# Altium project 24V_InjectorDriver.PrjPcb
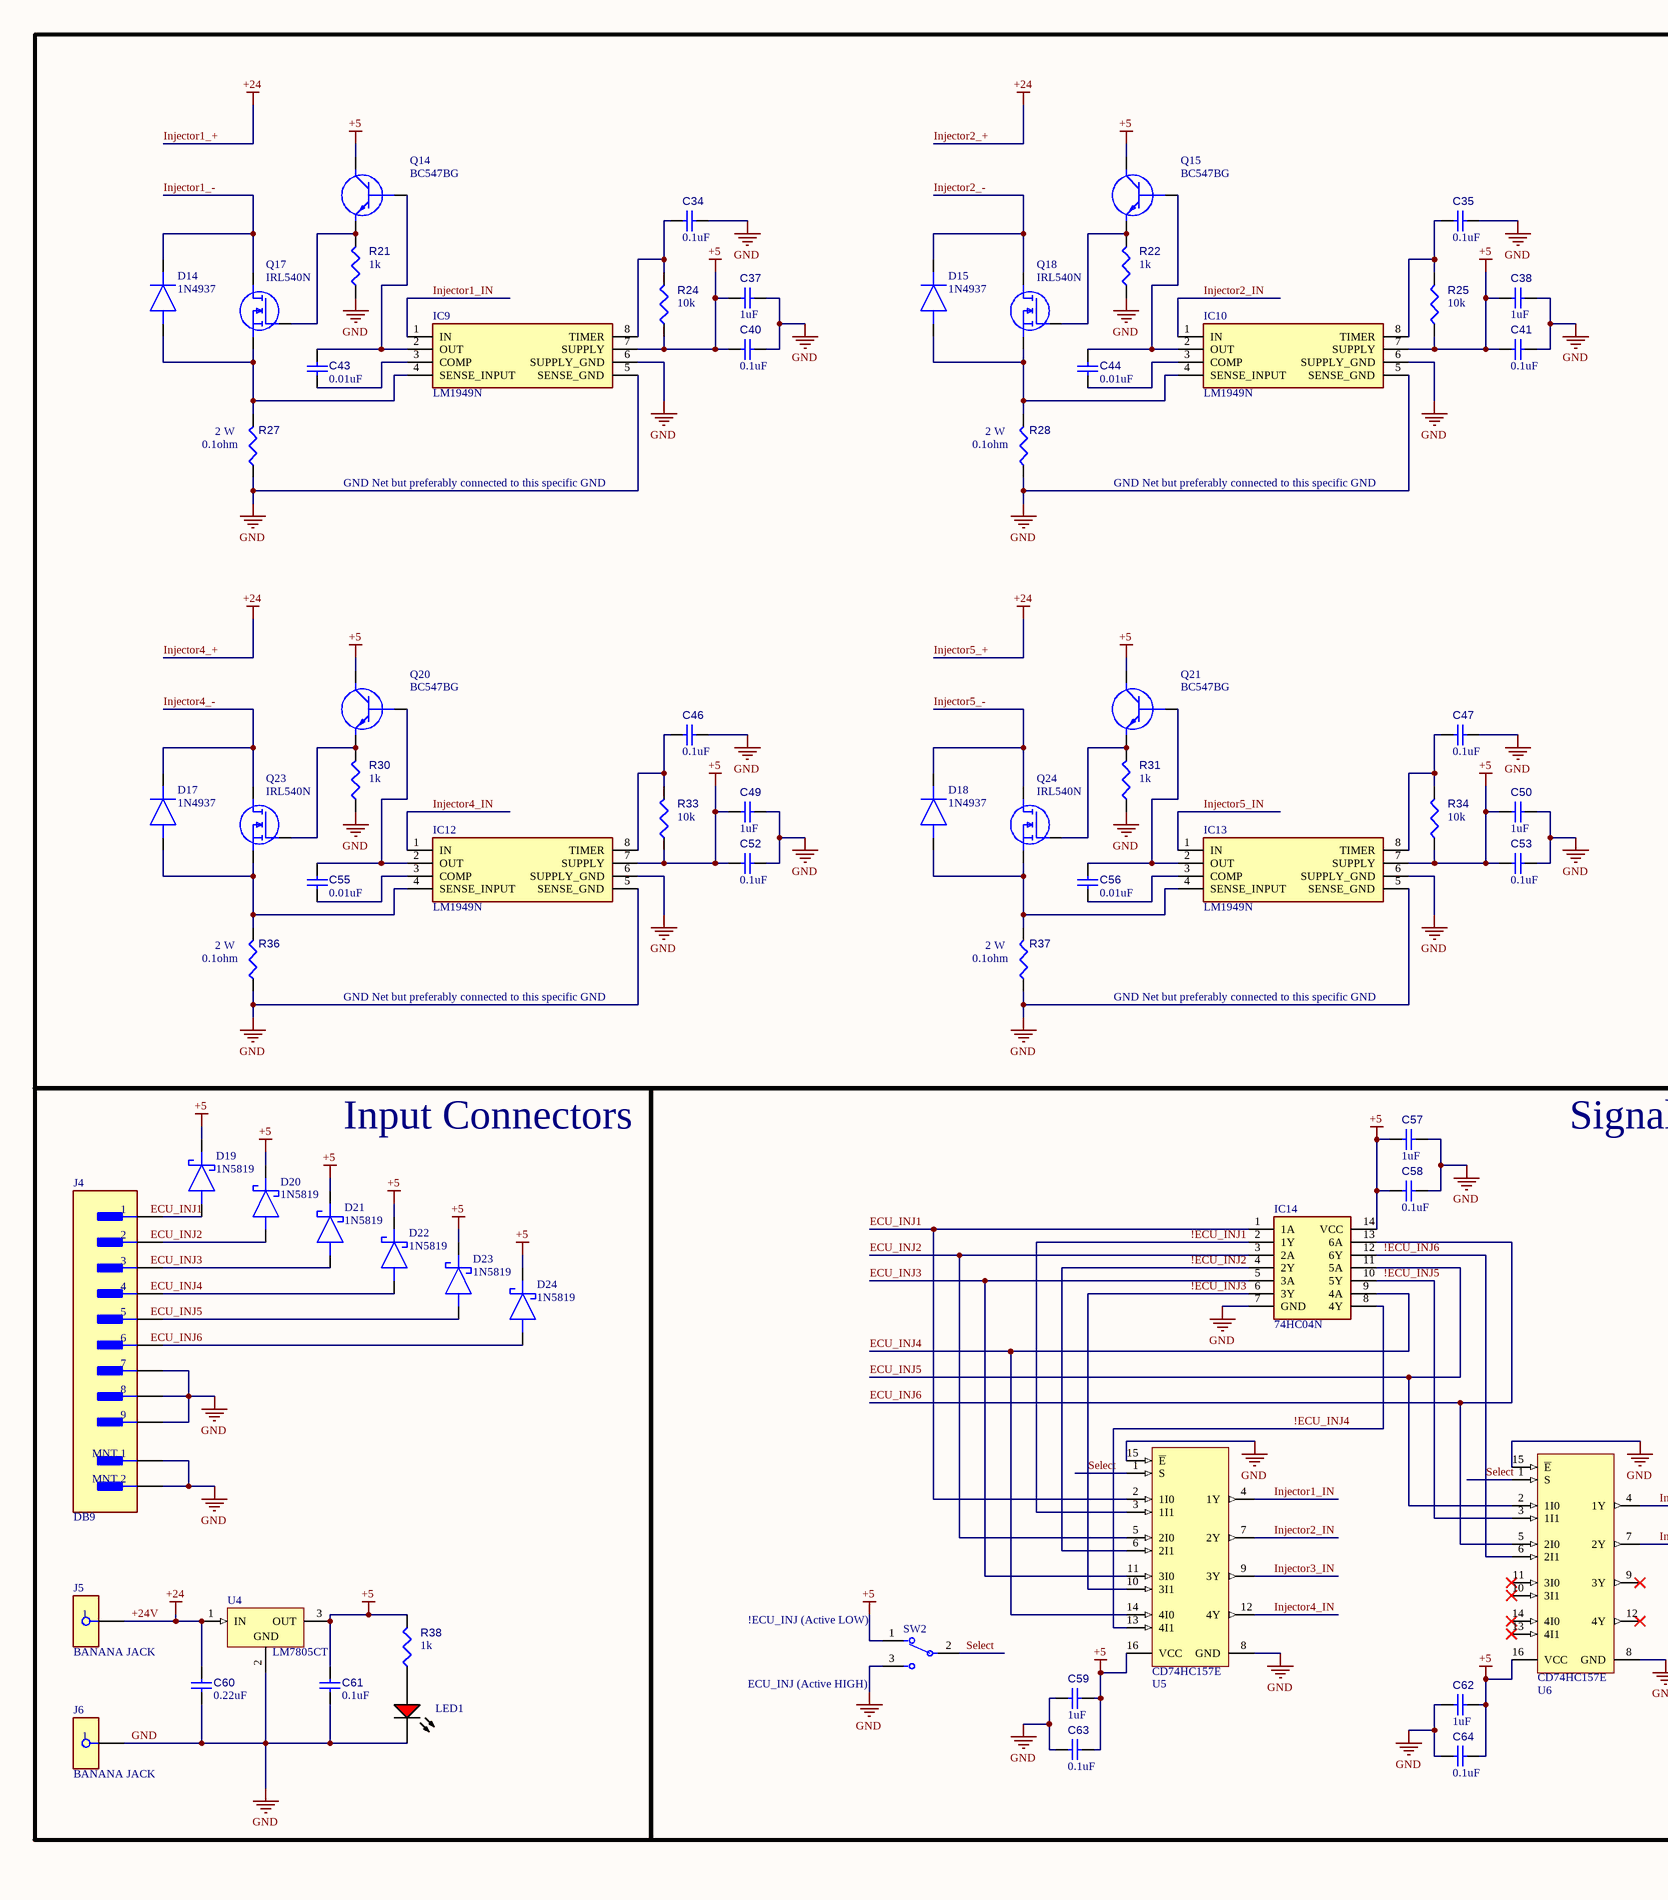
[diagram p0: 6x24V_InjectorDrivers.SchDoc, left]
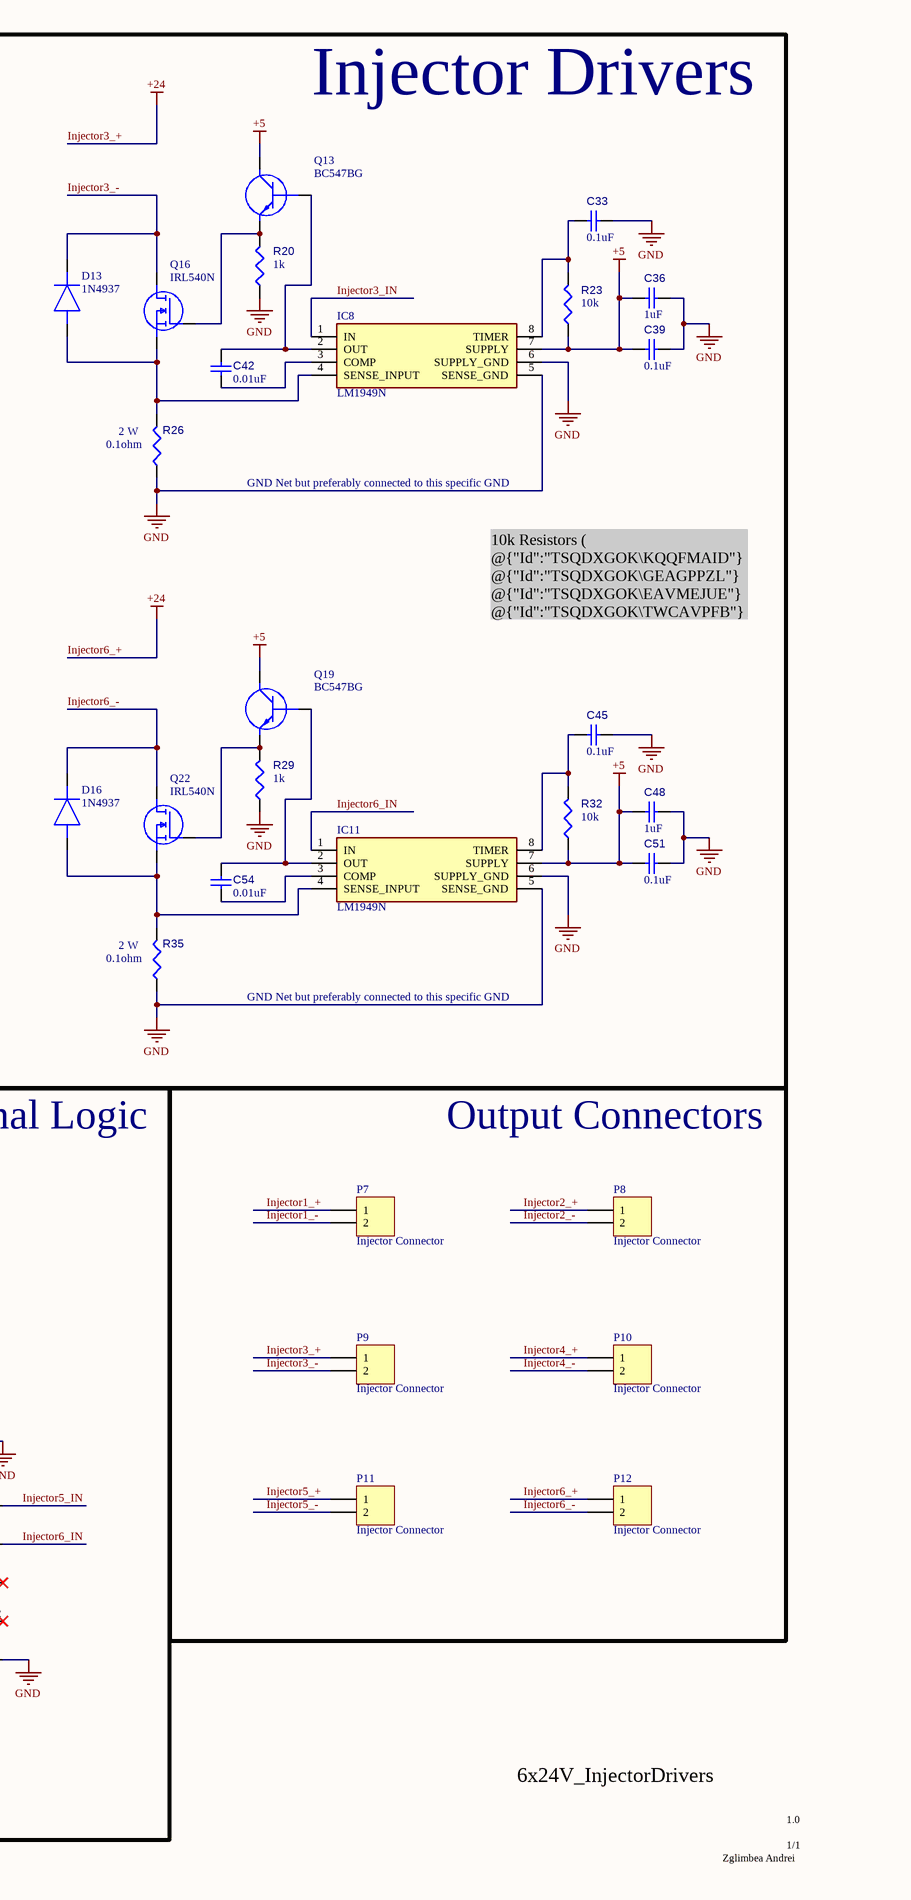
[diagram p1: 6x24V_InjectorDrivers.SchDoc, right]
1 sheet, 96 parts. Net scope: global (net labels, ports and power ports of the same name join across sheets).

## Sheet 6x24V_InjectorDrivers.SchDoc: 6x24V_InjectorDrivers
size C; ApprovedBy: Zglimbea Andrei; CheckedBy: Zglimbea Andrei; Author: Zglimbea Andrei; DrawnBy: Zglimbea Andrei; Engineer: Zglimbea Andrei; DocumentNumber: 1/1; Revision: 1.0; SheetNumber: 1; SheetTotal: 1

### Parts
C33  value 0.1uF  [CAPC0402(1005)60_L]  (hidden comment: 100nF 12V)
C34  value 0.1uF  [CAPC0402(1005)60_L]  (hidden comment: 100nF 12V)
C35  value 0.1uF  [CAPC0402(1005)60_L]  (hidden comment: 100nF 12V)
C36  value 1uF  [CAPC0402(1005)60_L]  (hidden comment: 1uF 12V)
C37  value 1uF  [CAPC0402(1005)60_L]  (hidden comment: 1uF 12V)
C38  value 1uF  [CAPC0402(1005)60_L]  (hidden comment: 1uF 12V)
C39  value 0.1uF  [CAPC0402(1005)60_L]  (hidden comment: 100nF 12V)
C40  value 0.1uF  [CAPC0402(1005)60_L]  (hidden comment: 100nF 12V)
C41  value 0.1uF  [CAPC0402(1005)60_L]  (hidden comment: 100nF 12V)
C42  value 0.01uF  [CAPC0402(1005)60_L]  (hidden comment: 10nF 12V)
C43  value 0.01uF  [CAPC0402(1005)60_L]  (hidden comment: 10nF 12V)
C44  value 0.01uF  [CAPC0402(1005)60_L]  (hidden comment: 10nF 12V)
C45  value 0.1uF  [CAPC0402(1005)60_L]  (hidden comment: 100nF 12V)
C46  value 0.1uF  [CAPC0402(1005)60_L]  (hidden comment: 100nF 12V)
C47  value 0.1uF  [CAPC0402(1005)60_L]  (hidden comment: 100nF 12V)
C48  value 1uF  [CAPC0402(1005)60_L]  (hidden comment: 1uF 12V)
C49  value 1uF  [CAPC0402(1005)60_L]  (hidden comment: 1uF 12V)
C50  value 1uF  [CAPC0402(1005)60_L]  (hidden comment: 1uF 12V)
C51  value 0.1uF  [CAPC0402(1005)60_L]  (hidden comment: 100nF 12V)
C52  value 0.1uF  [CAPC0402(1005)60_L]  (hidden comment: 100nF 12V)
C53  value 0.1uF  [CAPC0402(1005)60_L]  (hidden comment: 100nF 12V)
C54  value 0.01uF  [CAPC0402(1005)60_L]  (hidden comment: 10nF 12V)
C55  value 0.01uF  [CAPC0402(1005)60_L]  (hidden comment: 10nF 12V)
C56  value 0.01uF  [CAPC0402(1005)60_L]  (hidden comment: 10nF 12V)
C57  value 1uF  [CAPC0402(1005)60_L]  (hidden comment: 1uF 12V)
C58  value 0.1uF  [CAPC0402(1005)60_L]  (hidden comment: 100nF 12V)
C59  value 1uF  [CAPC0402(1005)60_L]  (hidden comment: 1uF 12V)
C60  value 0.22uF  [CAPC0402(1005)60_L]  (hidden comment: 220nF 50V)
C61  value 0.1uF  [CAPC0402(1005)60_L]  (hidden comment: 100nF 50V)
C62  value 1uF  [CAPC0402(1005)60_L]  (hidden comment: 1uF 12V)
C63  value 0.1uF  [CAPC0402(1005)60_L]  (hidden comment: 100nF 12V)
C64  value 0.1uF  [CAPC0402(1005)60_L]  (hidden comment: 100nF 12V)
D13  1N4937  [DIOAD1413W86L463D238]
D14  1N4937  [DIOAD1413W86L463D238]
D15  1N4937  [DIOAD1413W86L463D238]
D16  1N4937  [DIOAD1413W86L463D238]
D17  1N4937  [DIOAD1413W86L463D238]
D18  1N4937  [DIOAD1413W86L463D238]
D19  1N5819  [DIOAD1410W86L470D235]
D20  1N5819  [DIOAD1410W86L470D235]
D21  1N5819  [DIOAD1410W86L470D235]
D22  1N5819  [DIOAD1410W86L470D235]
D23  1N5819  [DIOAD1410W86L470D235]
D24  1N5819  [DIOAD1410W86L470D235]
IC8  LM1949N  [DIP794W53P254L959H508Q8N]
IC9  LM1949N  [DIP794W53P254L959H508Q8N]
IC10  LM1949N  [DIP794W53P254L959H508Q8N]
IC11  LM1949N  [DIP794W53P254L959H508Q8N]
IC12  LM1949N  [DIP794W53P254L959H508Q8N]
IC13  LM1949N  [DIP794W53P254L959H508Q8N]
IC14  74HC04N  [DIP762W53P254L1902H420Q14N]
J4  DB9  [FP-190-009-163R001-MFG]
J5  BANANA JACK  [FP-1581-5-MFG]
J6  BANANA JACK  [FP-1581-5-MFG]
LED1  LED  [VISH-TLMX1100_V]  (value not drawn)
P7  Injector Connector  [HDR1X2]
P8  Injector Connector  [HDR1X2]
P9  Injector Connector  [HDR1X2]
P10  Injector Connector  [HDR1X2]
P11  Injector Connector  [HDR1X2]
P12  Injector Connector  [HDR1X2]
Q13  BC547BG  [BC547BG]
Q14  BC547BG  [BC547BG]
Q15  BC547BG  [BC547BG]
Q16  IRL540N  [TO254P469X1042X1967-3P]
Q17  IRL540N  [TO254P469X1042X1967-3P]
Q18  IRL540N  [TO254P469X1042X1967-3P]
Q19  BC547BG  [BC547BG]
Q20  BC547BG  [BC547BG]
Q21  BC547BG  [BC547BG]
Q22  IRL540N  [TO254P469X1042X1967-3P]
Q23  IRL540N  [TO254P469X1042X1967-3P]
Q24  IRL540N  [TO254P469X1042X1967-3P]
R20  value 1k  [RESC0402(1005)_L]  (hidden comment: 1k 0.5W)
R21  value 1k  [RESC0402(1005)_L]  (hidden comment: 1k 0.5W)
R22  value 1k  [RESC0402(1005)_L]  (hidden comment: 1k 0.5W)
R23  value 10k  [RESC0402(1005)_L]  (hidden comment: 10k 0.5W)
R24  value 10k  [RESC0402(1005)_L]  (hidden comment: 10k 0.5W)
R25  value 10k  [RESC0402(1005)_L]  (hidden comment: 10k 0.5W)
R26  value 0.1ohm  Power: 2 W  [RESC0402(1005)_L]  (hidden comment: 0.1Ohm 2W)
R27  value 0.1ohm  Power: 2 W  [RESC0402(1005)_L]  (hidden comment: 0.1Ohm 2W)
R28  value 0.1ohm  Power: 2 W  [RESC0402(1005)_L]  (hidden comment: 0.1Ohm 2W)
R29  value 1k  [RESC0402(1005)_L]  (hidden comment: 1k 0.5W)
R30  value 1k  [RESC0402(1005)_L]  (hidden comment: 1k 0.5W)
R31  value 1k  [RESC0402(1005)_L]  (hidden comment: 1k 0.5W)
R32  value 10k  [RESC0402(1005)_L]  (hidden comment: 10k 0.5W)
R33  value 10k  [RESC0402(1005)_L]  (hidden comment: 10k 0.5W)
R34  value 10k  [RESC0402(1005)_L]  (hidden comment: 10k 0.5W)
R35  value 0.1ohm  Power: 2 W  [RESC0402(1005)_L]  (hidden comment: 0.1Ohm 2W)
R36  value 0.1ohm  Power: 2 W  [RESC0402(1005)_L]  (hidden comment: 0.1Ohm 2W)
R37  value 0.1ohm  Power: 2 W  [RESC0402(1005)_L]  (hidden comment: 0.1Ohm 2W)
R38  value 1k  [RESC0402(1005)_L]  (hidden comment: 1k 0.5W)
SW2  SPDT SW  [FP-A101SYCB04-MFG]  (value not drawn)
U4  LM7805CT  [FAIR-TO-220-3]
U5  CD74HC157E  [N0016A]
U6  CD74HC157E  [N0016A]

### Blocks framed on the sheet
Injector Drivers: C33-C56 D13-D18 IC8-IC13 Q13-Q24 R20-R37
Input Connectors: C60 C61 D19-D24 J4-J6 LED1 R38 U4
Signal Logic: C57-C59 C62-C64 IC14 SW2 U5 U6
Output Connectors: P7-P12

### Nets
+5: C36.1 C37.1 C38.1 C39.1 C40.1 C41.1 C48.1 C49.1 C50.1 C51.1 C52.1 C53.1 C57.1 C58.1 C59.2 C61.1 C62.2 C63.2 C64.2 D19.1(K) D20.1(K) D21.1(K) D22.1(K) D23.1(K) D24.1(K) IC8.7(SUPPLY) IC9.7(SUPPLY) IC10.7(SUPPLY) IC11.7(SUPPLY) IC12.7(SUPPLY) IC13.7(SUPPLY) IC14.14(VCC) Q13.1(C) Q14.1(C) Q15.1(C) Q19.1(C) Q20.1(C) Q21.1(C) R23.1 R24.1 R25.1 R32.1 R33.1 R34.1 R38.2 SW2.1 U4.3(OUT) U5.16(VCC) U6.16(VCC)
+24V: C60.1 J5.1 P7.1 P8.1 P9.1 P10.1 P11.1 P12.1 U4.1(IN)  [also labelled +24, Injector1_+, Injector2_+, Injector3_+, Injector4_+, Injector5_+, Injector6_+]
GND: C33.2 C34.2 C35.2 C36.2 C37.2 C38.2 C39.2 C40.2 C41.2 C45.2 C46.2 C47.2 C48.2 C49.2 C50.2 C51.2 C52.2 C53.2 C57.2 C58.2 C59.1 C60.2 C61.2 C62.1 C63.1 C64.1 IC8.5(SENSE_GND) IC8.6(SUPPLY_GND) IC9.5(SENSE_GND) IC9.6(SUPPLY_GND) IC10.5(SENSE_GND) IC10.6(SUPPLY_GND) IC11.5(SENSE_GND) IC11.6(SUPPLY_GND) IC12.5(SENSE_GND) IC12.6(SUPPLY_GND) IC13.5(SENSE_GND) IC13.6(SUPPLY_GND) IC14.7(GND) J4.7 J4.8 J4.9 J4.10(MNT_1) J4.11(MNT_2) J6.1 LED1.2(K) R20.1 R21.1 R22.1 R26.1 R27.1 R28.1 R29.1 R30.1 R31.1 R35.1 R36.1 R37.1 SW2.3 U4.2(GND) U5.8(GND) U5.15(~{E}) U6.8(GND) U6.15(~{E})
!ECU_INJ1: IC14.2(1Y) U5.3(1I1)
!ECU_INJ2: IC14.4(2Y) U5.6(2I1)
!ECU_INJ3: IC14.6(3Y) IC14.12(6Y) SW2.2 U5.1(S) U5.10(3I1) U6.1(S) U6.6(2I1)  [also labelled !ECU_INJ6, Select]
!ECU_INJ4: IC14.8(4Y) U5.13(4I1)
!ECU_INJ5: IC14.10(5Y) U6.3(1I1)
ECU_INJ1: IC14.1(1A) U5.2(1I0)
ECU_INJ2: IC14.3(2A) U5.5(2I0)
ECU_INJ3: IC14.5(3A) U5.11(3I0)
ECU_INJ4: IC14.9(4A) U5.14(4I0)
ECU_INJ5: IC14.11(5A) U6.2(1I0)
ECU_INJ6: IC14.13(6A) U6.5(2I0)
Injector1_-: D14.1(K) P7.2 Q17.2(D)
Injector1_IN: IC9.1(IN) U5.4(1Y)
Injector2_-: D15.1(K) P8.2 Q18.2(D)
Injector2_IN: IC10.1(IN) U5.7(2Y)
Injector3_-: D13.1(K) P9.2 Q16.2(D)
Injector3_IN: IC8.1(IN) U5.9(3Y)
Injector4_-: D17.1(K) P10.2 Q23.2(D)
Injector4_IN: IC12.1(IN) U5.12(4Y)
Injector5_-: D18.1(K) P11.2 Q24.2(D)
Injector5_IN: IC13.1(IN) U6.4(1Y)
Injector6_-: D16.1(K) P12.2 Q22.2(D)
Injector6_IN: IC11.1(IN) U6.7(2Y)
NetC33_1: C33.1 IC8.8(TIMER) R23.2
NetC34_1: C34.1 IC9.8(TIMER) R24.2
NetC35_1: C35.1 IC10.8(TIMER) R25.2
NetC42_1: C42.1 IC8.2(OUT) Q13.2(B)
NetC42_2: C42.2 IC8.3(COMP)
NetC43_1: C43.1 IC9.2(OUT) Q14.2(B)
NetC43_2: C43.2 IC9.3(COMP)
NetC44_1: C44.1 IC10.2(OUT) Q15.2(B)
NetC44_2: C44.2 IC10.3(COMP)
NetC45_1: C45.1 IC11.8(TIMER) R32.2
NetC46_1: C46.1 IC12.8(TIMER) R33.2
NetC47_1: C47.1 IC13.8(TIMER) R34.2
NetC54_1: C54.1 IC11.2(OUT) Q19.2(B)
NetC54_2: C54.2 IC11.3(COMP)
NetC55_1: C55.1 IC12.2(OUT) Q20.2(B)
NetC55_2: C55.2 IC12.3(COMP)
NetC56_1: C56.1 IC13.2(OUT) Q21.2(B)
NetC56_2: C56.2 IC13.3(COMP)
NetD13_2: D13.2(A) IC8.4(SENSE_INPUT) Q16.3(S) R26.2
NetD14_2: D14.2(A) IC9.4(SENSE_INPUT) Q17.3(S) R27.2
NetD15_2: D15.2(A) IC10.4(SENSE_INPUT) Q18.3(S) R28.2
NetD16_2: D16.2(A) IC11.4(SENSE_INPUT) Q22.3(S) R35.2
NetD17_2: D17.2(A) IC12.4(SENSE_INPUT) Q23.3(S) R36.2
NetD18_2: D18.2(A) IC13.4(SENSE_INPUT) Q24.3(S) R37.2
NetD19_2: D19.2(A) J4.1
NetD20_2: D20.2(A) J4.2
NetD21_2: D21.2(A) J4.3
NetD22_2: D22.2(A) J4.4
NetD23_2: D23.2(A) J4.5
NetD24_2: D24.2(A) J4.6
NetLED1_1: LED1.1(A) R38.1
NetQ13_3: Q13.3(E) Q16.1(G) R20.2
NetQ14_3: Q14.3(E) Q17.1(G) R21.2
NetQ15_3: Q15.3(E) Q18.1(G) R22.2
NetQ19_3: Q19.3(E) Q22.1(G) R29.2
NetQ20_3: Q20.3(E) Q23.1(G) R30.2
NetQ21_3: Q21.3(E) Q24.1(G) R31.2

Not connected (* = marked no-connect by the designer): U6 9(3Y)* 10(3I1)* 11(3I0)* 12(4Y)* 13(4I1)* 14(4I0)*

### Notes on the sheet
- GND Net but preferably connected to this specific GND
- 10k Resistors ( @{"Id":"TSQDXGOK\KQQFMAID"} @{"Id":"TSQDXGOK\GEAGPPZL"} @{"Id":"TSQDXGOK\EAVMEJUE"} @{"Id":"TSQDXGOK\TWCAVPFB"} @{"Id":"TSQDXGOK\MDQLMFGI"}  @{"Id":"TSQDXGOK\PTTVLVSA"} ) are actually variable resistors with the middle and last pins tied together
- (near SW2) !ECU_INJ (Active LOW)
- (near SW2) ECU_INJ (Active HIGH)
- 6x24V_InjectorDrivers
- Zglimbea Andrei
- 1/1
- 1.0
- Labels drawn without touching a wire or pin: ECU_INJ1, ECU_INJ2, ECU_INJ3, ECU_INJ4, ECU_INJ5, ECU_INJ6

### Library data of the parts
C33-C64 = CMP-001-00060-4: Chip Capacitor, 470nF +/-40%, 10V, 0402, Thickness 0.6 mm; Tolerance: 20%; Max Operating Temperature: 85°C; Case/Package: 0402; Voltage Rating: 10V; Min Operating Temperature: -55°C; Mounting Technology: SMT; Pins: 2
D13-D18 = 1N4937: Diode; Manufacturer_Name: onsemi; Datasheet Link: https://componentsearchengine.com/Datasheets/5/1N4937.pdf; Manufacturer_Part_Number: 1N4937; Mouser Part Number: 863-1N4937; Mouser Price/Stock: https://www.mouser.co.uk/ProductDetail/onsemi/1N4937?qs=y2kkmE52mdOT6THmIcI0Pw%3D%3D; Arrow Part Number: 1N4937; Arrow Price/Stock: https://www.arrow.com/en/products/1n4937/on-semiconductor
D19-D24 = 1N5819+: Schottky Diode; Manufacturer_Name: Multicomp Pro; Manufacturer_Part_Number: 1N5819+
IC8-IC13 = LM1949N: Integrated Circuit; Manufacturer_Name: Texas Instruments; Datasheet Link: https://www.ti.com/lit/gpn/LM1949; Height: 5.08mm; Manufacturer_Part_Number: LM1949N; Mouser Part Number: 926-LM1949N; Mouser Price/Stock: https://www.mouser.com/Search/Refine.aspx?Keyword=926-LM1949N
IC14 = 74HC04N: Integrated Circuit; Manufacturer_Name: Nexperia; Datasheet Link: https://datasheet.datasheetarchive.com/originals/distributors/Datasheets-AE/DSA3AE0000736.pdf; Height: 4.2mm; Manufacturer_Part_Number: 74HC04N
J4 = CMP-00542-00234286-1: 190-009-163R001 D Type Connector, 9 Contact(s), Male, 0.109 inch Pitch, Solder Terminal, #4-40; NexarPartId: 234286; Number of Positions: 9; Connector Type: D-Sub, Plug, Signal; Body Material: Steel; Voltage Rating: 300V; Current Rating: 5A; RoHS: Compliant; Mount: Edge, Surface Mount; Height: 11.38mm; Contact Material: Bronze, Gold; Housing Material: Nylon; REACH SVHC: No SVHC; Color: Black; Lead Free: Lead Free; Termination: SMD/SMT; Min Operating Temperature: -55°C; Max Operating Temperature: 105°C; Features: Shielded; Width: 3.91mm; Gender: Male; Number of Contacts: 9; Housing Color: Black; Length: 30mm; Contact Plating: Gold; Flammability Rating: UL94 V-0; Number of Rows: 2
J5 J6 = CMP-73906-000011-1: CONN BANANA JACK TURRET GREEN; Body Material: PC; Number of Contacts: 1; Max Current Rating: 15A; Voltage Rating (AC): 30V; Insulation: Mating End Insulated; Voltage Rating: 2.5kV; Voltage Rating (DC): 60V; Gender: Female; Height: 0.25inch; Mount: Panel; RoHS Compliant: Yes; Length: 1.22inch; Orientation: Straight; Diameter: 4.22mm; Lead Free: Lead Free; Package Quantity: 1; Termination: Turret; Current Rating: 15A; Packaging: Bag; Series: 1581; REACH SVHC: No SVHC; Number of Positions: 1; Contact Plating: Tin; Housing Color: Green; Contact Material: Brass; Insulation Material: Polycarbonate; Weight: 0.126lb; Number of Ports: 1; Color: Green; Housing Material: Polycarbonate; Width: 4inch
LED1 = CMP-007-00030-2: Red Led, 20mA, 2.1 V, -40 to 100 degC, 2-Pin SMD (0603), RoHS, Tape and Reel; Manufacturer: Vishay Semiconductor; Viewing Angle: 160degrees; Forward Voltage: 2.1V; Lens Style: Clear; Power: 90mW; Luminous Intensity: 63mcd; Datasheet Version: Rev. 2.7, 03/2016; Package Quantity: 3000; Colour: Red; Package Description: 2-Pin Surface Mount Device, Body 1.6 x 0.8 mm; Datasheet URL: http://www.vishay.com/docs/83173/tlmb1100.pdf; Package Reference: TLMX1100; Max Operating Temperature: 100°C; Mounting Technology: SM; Packaging: TapeandReel; Case/Package: 0603; Illumination Colour: Red; Forward Current: 20mA; Manufacturer URL: http://www.vishay.com/; RoHS Compliant: True; Min Operating Temperature: -40°C; Nominal Vf: 2.1V; Pins: 2
P7-P12 = Header 2: Header, 2-Pin; LatestRevisionDate: 17-Jul-2002; LatestRevisionNote: Re-released for DXP Platform.; Publisher: Altium Limited
Q13-Q15 Q19-Q21 = BC547BG: Transistor BJT NPN; Manufacturer_Name: onsemi; Datasheet Link: https://www.onsemi.com/download/data-sheet/pdf/BC546-D.PDF; Height: 5.33mm; Manufacturer_Part_Number: BC547BG; Mouser Part Number: N/A; Mouser Price/Stock: http://www.mouser.com/Search/ProductDetail.aspx?qs=NSmgnqlvnz5NIKIycfR5CQ%3d%3d; Arrow Part Number: BC547BG; Arrow Price/Stock: http://www.arrow.com/en/products/bc547bg/on-semiconductor
Q16-Q18 Q22-Q24 = IRL540N: MOSFET (N-Channel); Manufacturer_Name: Infineon; Datasheet Link: https://www.infineon.com/dgdl/Infineon-IRL540N-DataSheet-v01_01-EN.pdf?fileId=5546d462533600a40153565fc2a62567; Height: 4.69mm; Manufacturer_Part_Number: IRL540N
R20-R26 R29-R35 R38 = CMP-009-00155-3: Chip Resistor, 240 Ohms, +/-5 %, 63 mW, -55 to 155 degC, 0402; Tolerance: 5%; Case/Package: 0402; Pins: 2; Max Operating Temperature: 155°C; Min Operating Temperature: -55°C
R27 R28 R36 R37 = CMP-009-00155-3: 0.1 Ohm 1% 0.5W; Tolerance: 5%; Case/Package: 0402; Pins: 2; Max Operating Temperature: 155°C; Min Operating Temperature: -55°C
SW2 = CMP-03408-000017-1: SWITCH TOGGLE SPDT 0.4VA 20V; Electrical Life: 6000Cycles; Number of Poles: 1; Power Rating: 400mW; Switch Function: On-On; Contact Resistance: 10mR; Contact Current Rating: 400mA; Actuator Material: Phenolic; Insulation Resistance: 30MR; Actuator Color: Chrome; Number of Positions: 2; Actuator Type: Standard Round; Actuator Length: 10.41mm; Illumination Type: Non-Illuminated; Flammability Rating: UL94 V-1; Contact Material: Copper; Depth: 6.86mm; Contact Plating: Gold; Voltage Rating (AC): 20V; Max Voltage Rating (DC): 20V; Min Operating Temperature: -30°C; Max Operating Temperature: 85°C; Throw Configuration: SPDT; Packaging: Bulk; Termination: PC Pins; Series: Gemini A; ELV: Compliant; Lead Free: Lead Free; RoHS Compliant: Yes; REACH SVHC: No SVHC; Mount: Panel; Orientation: Straight; Package Quantity: 100; Max Voltage Rating (AC): 20V; Radiation Hardening: No; Voltage Rating (DC): 20V
U4 = CMP-2000-04938-1: Positive Voltage Regulator, 5 V, 1 A, -40 to 125 degC, 3-Pin TO-220, RoHS, Tube; Manufacturer: FairchildSemiconductor; Maximum Input Voltage: 35V; Maximum Quiescent Current: 8mA; Load Regulation: 100mV; Maximum Output Current: 2.2(Typ)A; Output Type: Fixed; Typical Dropout Voltage @ Current: 2@1AV; Rad Hard: No; Output Voltage: 5V; Accuracy: ±4%; Number of Outputs: 1; Category: LinearRegulator; Package Description: 3-Pin Through Hole Device, Body 10 x 4.5 mm, Pitch 2.54 mm; Packaging: Rail/Tube; Mounting: ThroughHole; Polarity: Positive; Manufacturer URL: https://www.fairchildsemi.com/; Line Regulation: 100mV; Datasheet Version: Aug-12; Datasheet URL: https://datasheet.ciiva.com/26904/lm7805ct-26904988.pdf; Package Reference: TO-220; Package URL: https://www.fairchildsemi.com/package-drawings/TO/TO220B03.pdf; Package: 3TO-220AB; Operating Temperature: -40to125degC; Type: Linear
U5 U6 = CMP-1633-00723-2: High Speed CMOS Logic Quad 2-Input Multiplexers, N0016A, TUBE; Manufacturer: Texas Instruments; Channels(#): 4; VCC(Max)(V): 6; Technology Family: HC; Input Type: LVTTL/CMOS; Rating: Catalog; Schmitt Trigger: No; Function: Encoder/Multiplexer; VCC(Min)(V): 2; F @ Nom Voltage(Max)(Mhz): 28; ICC @ Nom Voltage(Max)(mA): 0.08; Output Drive (IOL/IOH)(Max)(mA): 5.2/-5.2; Voltage(Nom)(V): 3.3,5; tpd @ Nom Voltage(Max)(ns): 10; Configuration: 2：1; DatasheetVersion: SCHS153C; Type: Standard; Generic Part Number: CD74HC157; PackageReference: N0016A; Output Type: CMOS; Code_JEDEC: MS-001; Bits(#): 2; Operating Temperature Range(C): -55 to 125